# EAGLE design iac_driver (EAGLE 6.4)
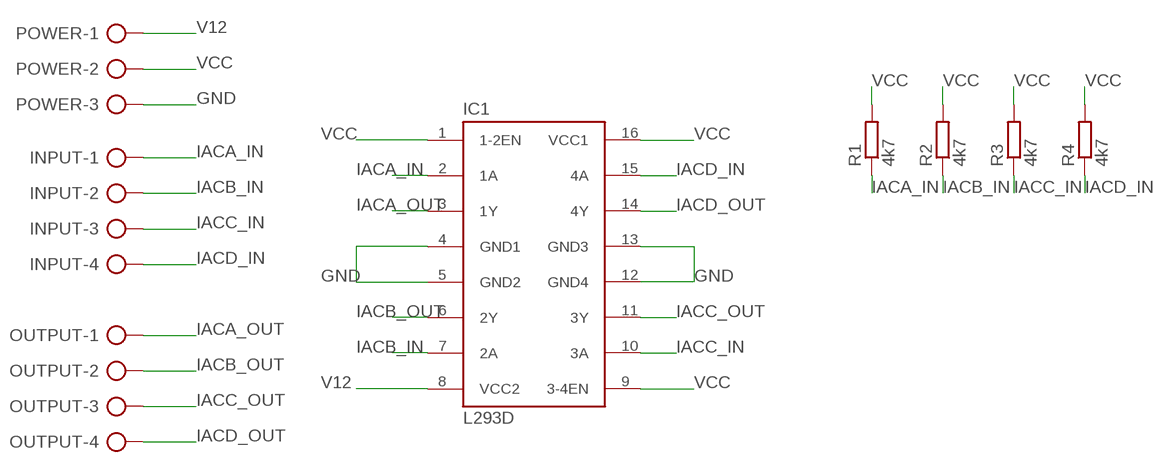
[diagram p0: schematic, sheet 1]

## Parts
IC1  L293D  [DIL16]
INPUT  AK500/4  [AK500/4]
OUTPUT  AK500/4  [AK500/4]
POWER  AK500/3  [AK500/3]
R1  4k7  R-EU_0204/7  [0204/7]
R2  4k7  R-EU_0204/7  [0204/7]
R3  4k7  R-EU_0204/7  [0204/7]
R4  4k7  R-EU_0204/7  [0204/7]

## Nets
GND: IC1.4(GND1) IC1.5(GND2) IC1.12(GND4) IC1.13(GND3) POWER.3
IACA_IN: IC1.2(1A) INPUT.1 R1.1
IACA_OUT: IC1.3(1Y) OUTPUT.1
IACB_IN: IC1.7(2A) INPUT.2 R2.1
IACB_OUT: IC1.6(2Y) OUTPUT.2
IACC_IN: IC1.10(3A) INPUT.3 R3.1
IACC_OUT: IC1.11(3Y) OUTPUT.3
IACD_IN: IC1.15(4A) INPUT.4 R4.1
IACD_OUT: IC1.14(4Y) OUTPUT.4
V12: IC1.8(VCC2) POWER.1
VCC: IC1.1(1-2EN) IC1.9(3-4EN) IC1.16(VCC1) POWER.2 R1.2 R2.2 R3.2 R4.2

## Library data of the parts
IC1 = st-microelectronics:L293D: PUSH-PULL 4 CHANNEL DRIVER; MPN: L293D; OC_FARNELL: 9589619; OC_NEWARK: 56P8249
INPUT OUTPUT = con-ptr500:AK500/4: CONNECTOR; OC_FARNELL: unknown; OC_NEWARK: unknown
POWER = con-ptr500:AK500/3: CONNECTOR; OC_FARNELL: unknown; OC_NEWARK: unknown
R1-R4 = resistor:R-EU_: RESISTOR, European symbol

## Board
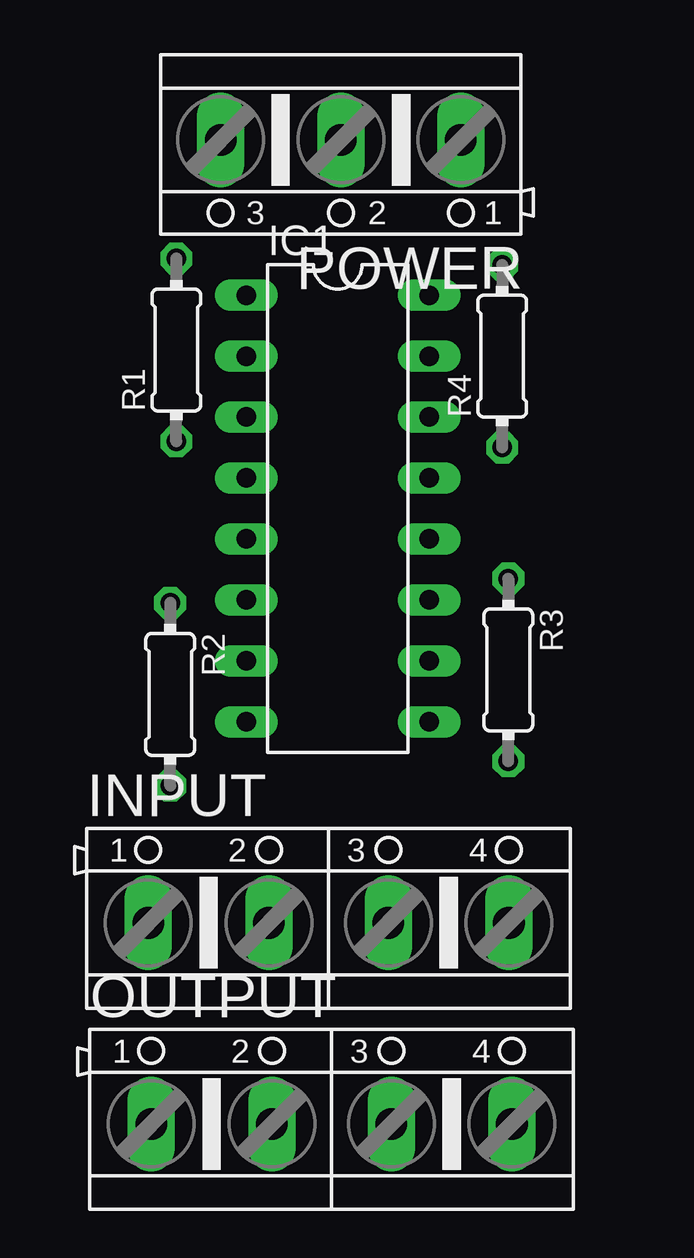
[diagram p1: board, top side]
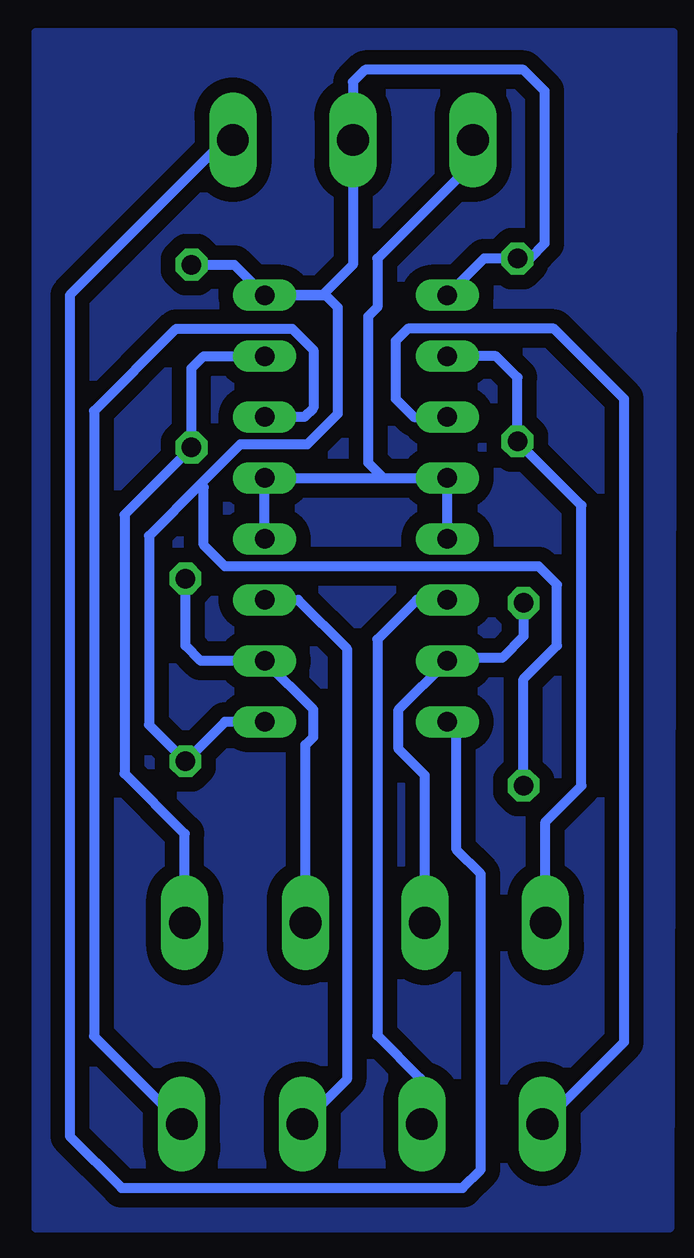
[diagram p2: board, bottom side, seen from below]

No outline drawn. Coordinates in mm, seen from the top.
Copper layers (1*16): Top 0.035mm / dielectric 1.5mm / Bottom 0.035mm
Design rules "default": minimum track width 10mil, minimum drill 24mil, track to track 8mil, track to pad 8mil, pad to pad 8mil, via to via 8mil, smd to smd 8mil, copper to edge 40mil, drill to drill 8mil, minimum pad ring 10mil, minimum via ring 8mil, stop-mask expansion 4mil, vias tented up to drill 0mil, thermal gap 10mil

### Footprints (pad centres in the part's own frame; a part is rotated, then mirrored left to right if it is on the bottom)
DIL16 = drill 0.813 long: 1 -8.89,-3.81; 2 -6.35,-3.81; 3 -3.81,-3.81; 4 -1.27,-3.81; 5 1.27,-3.81; 6 3.81,-3.81; 7 6.35,-3.81; 8 8.89,-3.81; 9 8.89,3.81; 10 6.35,3.81; 11 3.81,3.81; 12 1.27,3.81; 13 -1.27,3.81; 14 -3.81,3.81; 15 -6.35,3.81; 16 -8.89,3.81
AK500/4 = drill 1.321 long: 1 -7.518,0; 2 -2.489,0; 3 2.489,0; 4 7.518,0
AK500/3 = drill 1.321 long: 1 -5.004,0; 2 0,0; 3 5.004,0
0204/7 = drill 0.813 octagon: 1 -3.81,0; 2 3.81,0

### Placement (x,y rotation side)
IC1  48.26,43.18 270 top
INPUT  47.88,25.91 0 top
OUTPUT  48.01,17.53 0 top
POWER  48.39,58.55 180 top
R1  41.53,49.78 90 top
R2  41.27,35.43 270 top
R3  55.37,36.45 270 top
R4  55.12,49.53 90 top

### Tracks (layer width: path | path; a pad name or v marks a point on that pad's centre or on a via)
GND
  Bottom 0.406: IC1.5 IC1.4 47.12,44.45 | IC1.12 IC1.13 47.12,44.45 | POWER.3 43.38,57.58 47.37,53.59 47.37,51.56 47.75,51.18 47.75,45.09 47.12,44.45
IACA_IN
  Bottom 0.406: INPUT.1 40.36,30.12 38.86,31.62 38.86,43.31 R1.1 41.53,48.64 42.42,49.53 IC1.2
IACA_OUT
  Bottom 0.406: OUTPUT.1 37.08,20.93 37.08,47.75 40.01,50.67 46.1,50.67 46.61,50.16 46.61,47.75 45.85,46.99 IC1.3
IACB_IN
  Bottom 0.406: R2.1 41.27,37.85 42.16,36.96 44.32,36.96 IC1.7 46.48,34.8 46.48,33.15 45.39,32.05 INPUT.2
IACB_OUT
  Bottom 0.406: IC1.6 45.72,39.37 47.37,37.72 47.37,21.21 45.59,19.43 45.59,17.6 OUTPUT.2
IACC_IN
  Bottom 0.406: R3.1 55.37,37.47 54.74,36.83 IC1.10 50.04,34.8 50.04,33.66 50.37,33.33 INPUT.3
IACC_OUT
  Bottom 0.406: IC1.11 50.67,39.37 48.64,37.34 48.64,19.38 OUTPUT.3
IACD_IN
  Bottom 0.406: INPUT.4 55.4,29.62 57.91,32.13 57.91,42.93 R4.1 55.12,49.02 54.61,49.53 IC1.15
IACD_OUT
  Bottom 0.406: OUTPUT.4 59.18,21.18 59.18,47.24 55.75,50.67 50.93,50.67 50.04,49.78 50.04,47.37 50.42,46.99 IC1.14
N$1
  pour Bottom (isolate 0.61): 35.05,62.99 61.59,62.99 61.59,13.21 35.18,13.21
V12
  Bottom 0.406: POWER.1 53.72,58.55 60.2,52.07 60.2,17.02 58.04,14.86 43.81,14.86 43.05,15.62 43.05,27.94 44.07,28.96 44.07,33.91 IC1.8
VCC
  Bottom 0.406: IC1.16 49.66,52.07 48.39,53.34 POWER.2 48.39,60.96 47.88,61.47 41.27,61.47 40.39,60.58 40.39,54.23 41.02,53.59 R1.2 42.93,53.59 IC1.1 | R4.2 53.34,53.34 IC1.16 | IC1.9 53.72,34.29 R3.2 56.9,34.16 56.9,42.04 54.74,44.2 | IC1.16 49.53,52.07 49.02,51.56 49.02,47.12 50.29,45.85 53.09,45.85 54.74,44.2 | R2.2 41.27,36.07 39.88,37.47 39.88,40.01 40.64,40.77 53.72,40.77 54.61,41.66 54.61,44.07 54.74,44.2